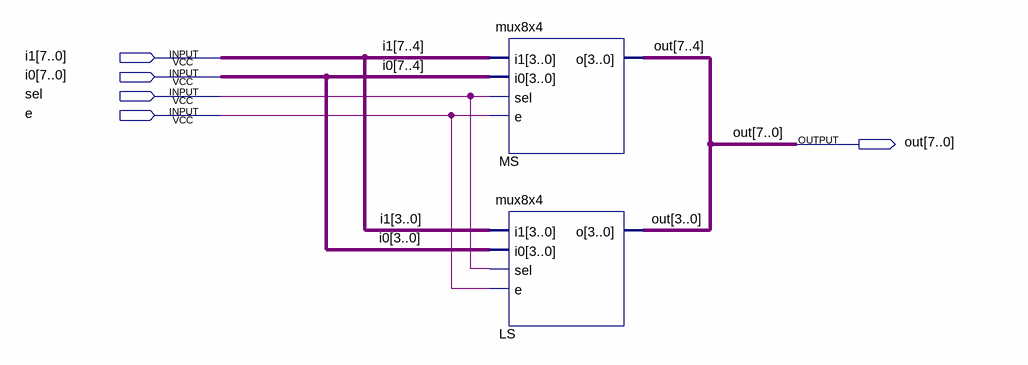
[diagram p0: schematic sheet]
// Quartus schematic mux16x8.bdf as structural Verilog: 2 symbols, 5 pins
module mux16x8 (
  input  [7:0] i1,
  input  [7:0] i0,
  input  sel,
  input  e,
  output [7:0] out
);

  mux8x4 MS (.i1(i1[7:4]), .i0(i0[7:4]), .sel(sel), .e(e), .o(out[7:4]));
  mux8x4 LS (.i1(i1[3:0]), .i0(i0[3:0]), .sel(sel), .e(e), .o(out[3:0]));
endmodule
